# EAGLE schematic Ampli-2020 (EAGLE 7.2.0)
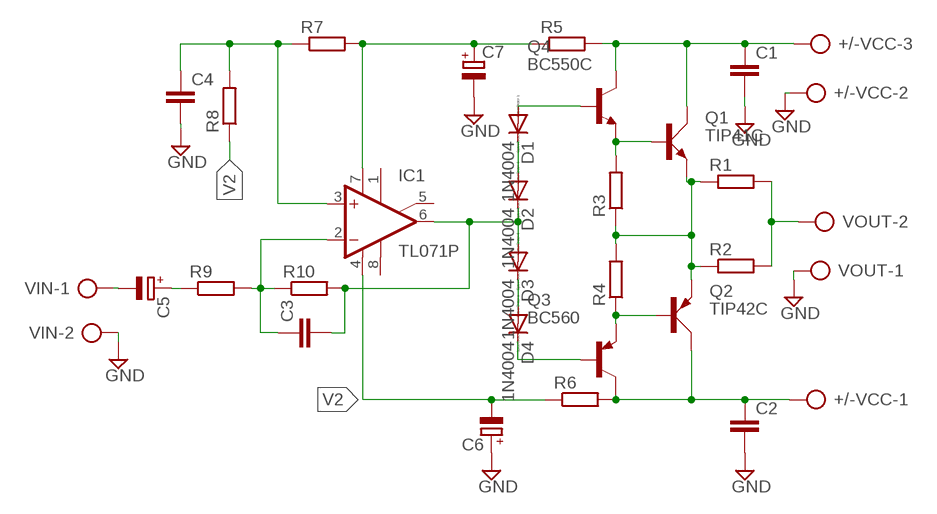
[diagram p0: schematic, sheet 1]

## Parts
+/-VCC  AK500/3  [AK500/3]
C1  C-EU050-025X075  [C050-025X075]
C2  C-EU050-025X075  [C050-025X075]
C3  C-EU050-025X075  [C050-025X075]
C4  C-EU050-025X075  [C050-025X075]
C5  CPOL-EUE2.5-5  [E2,5-5]
C6  CPOL-EUE2.5-7  [E2,5-7]
C7  CPOL-EUE2.5-7  [E2,5-7]
D1  1N4004  [DO41-10]
D2  1N4004  [DO41-10]
D3  1N4004  [DO41-10]
D4  1N4004  [DO41-10]
IC1  TL071P  [DIL08]
Q1  TIP41C  [TO220AV]
Q2  TIP42C  [TO220AV]
Q3  BC560  [TO92-EBC]
Q4  BC550C  [TO92-EBC]
R1  R-EU_0617/17  [0617/17]
R2  R-EU_0617/17  [0617/17]
R3  R-EU_0207/7  [0207/7]
R4  R-EU_0207/7  [0207/7]
R5  R-EU_0207/7  [0207/7]
R6  R-EU_0207/7  [0207/7]
R7  R-EU_0207/7  [0207/7]
R8  R-EU_0207/7  [0207/7]
R9  R-EU_0207/7  [0207/7]
R10  R-EU_0207/7  [0207/7]
VIN  AK500/2  [AK500/2]
VOUT  AK500/2  [AK500/2]

## Nets
GND: +/-VCC.2 C1.2 C2.2 C4.2 C6.+ C7.- VIN.2 VOUT.1
N$1: Q2.B Q3.E R4.1
N$2: D1.C D2.A
N$3: C3.2 D2.C D3.A IC1.6(OUT) R10.2
N$4: D3.C D4.A
N$5: D1.A Q4.B
N$6: Q1.B Q4.E R3.2
N$7: Q1.E Q2.E R1.1 R2.1 R3.1 R4.2
N$8: D4.C Q3.B
N$11: R1.2 R2.2 VOUT.2
N$12: C5.+ R9.1
N$13: +/-VCC.1 C2.1 Q2.C Q3.C R6.2
N$14: C5.- VIN.1
N$16: +/-VCC.3 C1.1 Q1.C Q4.C R5.2
N$17: C7.+ IC1.7(V+) R5.1 R7.2
N$19: C3.1 IC1.2(-IN) R9.2 R10.1
N$24: C4.1 IC1.3(+IN) R7.1 R8.2
V2: C6.- IC1.4(V-) R6.1 R8.1
Unconnected: IC1.1(ON1) IC1.5(ON2) IC1.8(OPT)

## Library data of the parts
+/-VCC = con-ptr500:AK500/3: CONNECTOR; OC_FARNELL: unknown; OC_NEWARK: unknown
C1-C4 = rcl:C-EU: CAPACITOR, European symbol
C5-C7 = rcl:CPOL-EU: POLARIZED CAPACITOR, European symbol
D1-D4 = diode:1N4004: DIODE general purpose rectifier, 1 A
IC1 = linear:TL071: OP AMP
Q1 = transistor-power:TIP41C: NPN TRANSISTOR
Q2 = transistor-power:TIP42C: PNP TRANSISTOR
Q3 = transistor-pnp:BC560*: PNP Transistror
Q4 = transistor-npn:BC550*: NPN Transistor
R1-R10 = rcl:R-EU_: RESISTOR, European symbol
VIN VOUT = con-ptr500:AK500/2: CONNECTOR; OC_FARNELL: unknown; OC_NEWARK: unknown